# Altium schematic sheet Sheet1.SchDoc
size A4
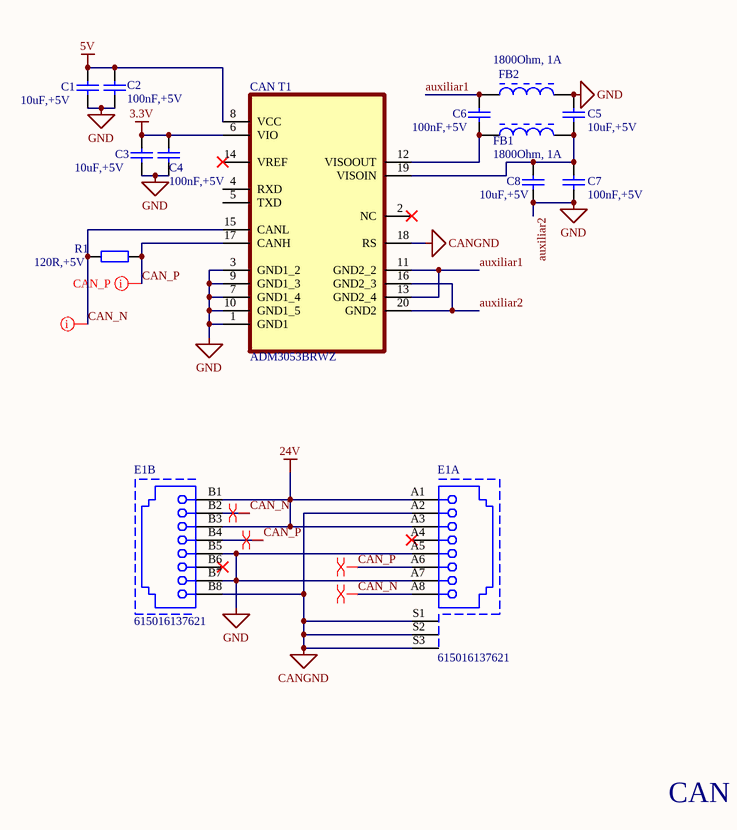
[diagram p0: Sheet1.SchDoc]

## Parts
C1  10uF,+5V  [WCAP-CSGP_0805_H=1.25mm]
C2  100nF,+5V  [WCAP-CSGP_1206_H=1.15mm]
C3  10uF,+5V  [WCAP-CSGP_0805_H=1.25mm]
C4  100nF,+5V  [WCAP-CSGP_1206_H=1.15mm]
C5  10uF,+5V  [WCAP-CSGP_0805_H=1.25mm]
C6  100nF,+5V  [WCAP-CSGP_1206_H=1.15mm]
C7  100nF,+5V  [WCAP-CSGP_1206_H=1.15mm]
C8  10uF,+5V  [WCAP-CSGP_0805_H=1.25mm]
CAN_T1  ADM3053BRWZ  [SOIC127P1032X265-20N]
E1  615016137621  [615016137621]  (parts A,B of 2)
FB1  1800Ohm, 1A  [WE-CBF_0805_Wide Band]
FB2  1800Ohm, 1A  [WE-CBF_0805_Wide Band]
R1  120R,+5V  [WRIS-KSKE_0805]

## Nets
3.3V: C3.2 C4.2 CAN_T1.6(VIO)
5V: C1.2 C2.2 CAN_T1.8(VCC)
24V: E1.A1 E1.A3 E1.B1 E1.B3
auxiliar2: C1.1 C2.1 C3.1 C4.1 C5.2 C7.1 C8.1 CAN_T1.1(GND1) CAN_T1.3(GND1_2) CAN_T1.7(GND1_4) CAN_T1.9(GND1_3) CAN_T1.10(GND1_5) CAN_T1.16(GND2_3) CAN_T1.20(GND2) E1.A5 E1.A7 E1.B5 E1.B7 FB2.2  [also labelled GND]
CANGND: CAN_T1.18(RS) E1.A2 E1.B8 E1.S1 E1.S2 E1.S3
auxiliar1: C6.2 CAN_T1.11(GND2_2) CAN_T1.13(GND2_4) FB2.1
CAN_N: CAN_T1.15(CANL) E1.A8 E1.B2 R1.1
CAN_P: CAN_T1.17(CANH) E1.A6 E1.B4 R1.2
NetC5_1: C5.1 C7.2 C8.2 CAN_T1.19(VISOIN) FB1.2
NetC6_1: C6.1 CAN_T1.12(VISOOUT) FB1.1

Not connected (* = marked no-connect by the designer): CAN_T1 2(NC)* 4(RXD) 5(TXD) 14(VREF)*; E1 A4* B6*

## Layout directives
differential pair: CAN_N, CAN_P

## Notes on the sheet
- CAN

## Library data of the parts
C1 C3 C5 C8 = 885012207126_7: WCAP-CSGP Multilayer Ceramic Chip Capacitor, General Purpose, size 0805, X7R, 47nF, 100V; Manufacturer: Wurth Elektronik; Rated Voltage: 100VDC; Isolation Resistance: >=2.1GOhm; Capacitance Tolerance: +/-10%; Technical Reference: X7R0805473K100DFCT10000; ComponentLink1Description: Manufacturer; ComponentLink1URL: http://www.we-online.de; ComponentLink2Description: Datasheet; ComponentLink2URL: https://www.we-online.com/catalog/datasheet/885012207126.pdf; Operating Temperature: -55 to +125degC; Packaging: Tape and Reel; Manufacturer Part Number: 885012207126; Published Date: May 2020; Ceramic Type: X7R; Dissipation Factor: =<2.5%; Height: 1.25mm; Mounting Technology: SMT; Size: 0805; Capacitance: 47nF
C2 C4 C6 C7 = 885012208013_4: WCAP-CSGP General Purpose Ceramic Capacitors, size 1206, 1uF, +/-10%, 10VDC; Isolation Resistance: >=0.5GOhm; Ceramic Type: X7R; Technical Reference: X7R1206105K010DFCT10000; ComponentLink1Description: Manufacturer; ComponentLink1URL: http://www.we-online.de; ComponentLink2Description: Datasheet; ComponentLink2URL: https://katalog.we-online.com/pbs/datasheet/885012208013.pdf; Operating Temperature: -55 to +125degC; Packaging: Tape and Reel; Part Number: 885012208013; Publisher: Wurth Elektronik; Rated Voltage: 10VDC; Published Date: August 2019; Capacitance Tolerance: +/-10%; Dissipation Factor: =<5%; Height: 1.15mm +/-0.15mm; Mounting Technology: SMT; Size: 1206; Capacitance: 1uF
CAN_T1 = ADM3053BRWZ: DGT ISOL 2500VRMS 2CH CAN 20SOIC; MF: Analog Devices; Availability: Unavailable; SnapEDA_Link: https://www.snapeda.com/parts/ADM3053BRWZ/Analog%20Devices%20Inc./view-part/51768/?ref=snap; Price: None; MP: ADM3053BRWZ; Package: SOIC -20 Analog Devices; Value: *
E1 = 615016137621: WR-MJ Modular Jack THT Horizontal Shielded Dual Port 8P8C Tab Down; Rated Current: 1.5A; Contact Resistance: 20mOhm; Insulation Resistance: 500MOhm; Working Voltage: 120VAC; Withstanding Voltage: 1000VAC; ComponentLink1Description: Manufacturer; ComponentLink1URL: http://www.we-online.de; ComponentLink2Description: Datasheet; ComponentLink2URL: https://katalog.we-online.com/em/datasheet/615016137621.pdf; Packaging: Tray; Publisher: Wurth Elektronik; Mounting Technology: THT; Operating Temperature: -40 to +85degC; Part Number: 615016137621; Published Date: November 2019; xPxC: 8P8C; Type: Horizontal
FB1 FB2 = 742792090: WE-CBF SMT EMI Suppression Ferrite Bead, size 0805, 1800Ohm, 1A; Manufacturer: Wurth Elektronik; Impedance max.: 2000Ohm; DC Resistance max.: 0.4Ohm; Type: Wide Band; ComponentLink1Description: Manufacturer; ComponentLink1URL: http://www.we-online.de; ComponentLink2Description: Datasheet; ComponentLink2URL: https://www.we-online.com/catalog/datasheet/742792090.pdf; Operating Temperature: -55 to +125degC; Packaging: Tape and Reel; Published Date: March 2020; Rated Current: 1A; Manufacturer Part Number: 742792090; Impedance @100MHz: 1800Ohm; Mounting Technology: SMT; Size: 0805
R1 = 560050320011_9: WRIS-KSKE SMT Thick Film Resistor, size 0805, 1Ohm, 0.33W; Manufacturer: Wurth Elektronik; Rated Current: 0.57A; Temperature Coefficient of Resistance: +/-100ppm/degC; Technical Reference: KE08051R00F103KAATP0000; Resistance Tolerance: +/-1%; ComponentLink1Description: Manufacturer; ComponentLink1URL: http://www.we-online.de; ComponentLink2Description: Datasheet; ComponentLink2URL: https://www.we-online.com/catalog/datasheet/560050320011.pdf; Published Date: May 2020; Rated Power: 0.33W; Resistance: 1Ohm; Height: 0.6mm; Operating Temperature: -55 to +155degC; Mounting Technology: SMT; Packaging: Tape and Reel; Size: 0805; Length: 2mm; Manufacturer Part Number: 560050320011; Width: 1.25mm